# Altium project PCB_Project.PrjPcb
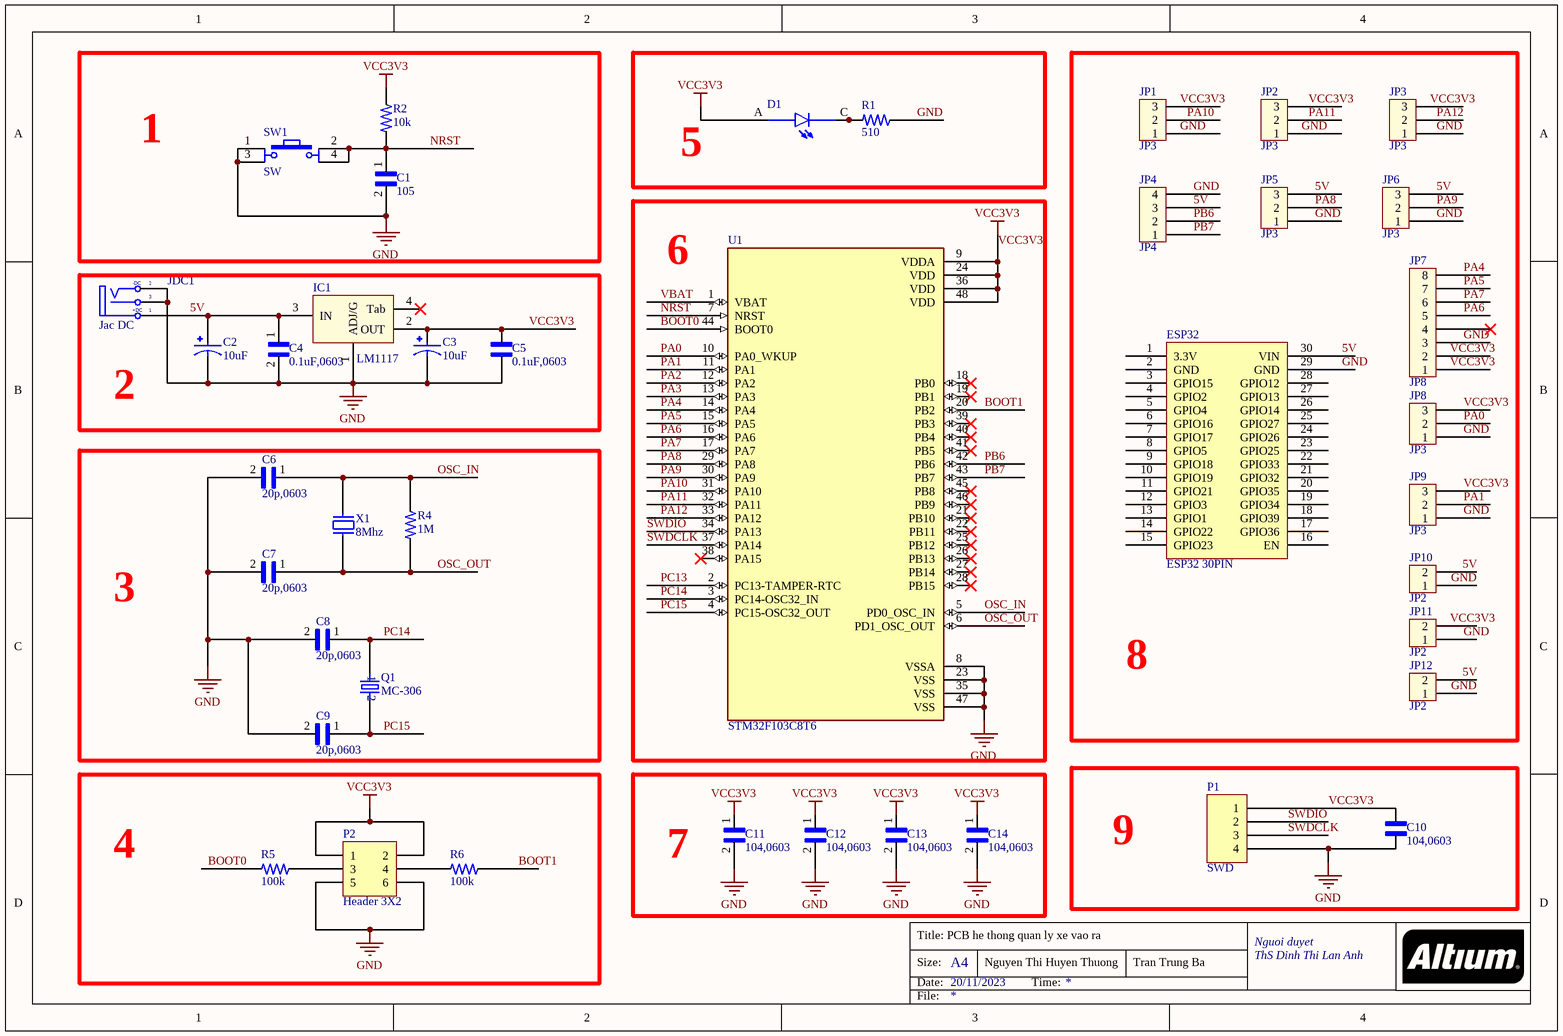
[diagram p0: Sheet1.SchDoc]
1 sheet, 41 parts. Net scope: global (net labels, ports and power ports of the same name join across sheets).
Board file: PCB1.PcbDoc

## Sheet Sheet1.SchDoc
size A4; Organization: Altium Limited; Address1: L3, 12a Rodborough Rd; Address2: Frenchs Forest; Address3: NSW; Address4: Australia 2086

### Parts
C1  105  [CAPC1608X90]
C2  10uF  [CAP_EEE1EA100WAR]
C3  10uF  [CAP_EEE1EA100WAR]
C4  0.1uF,0603  [CAPC1608X90]
C5  0.1uF,0603  [CAPC1608X90]
C6  20p,0603  [CAPC1608X90]
C7  20p,0603  [CAPC1608X90]
C8  20p,0603  [CAPC1608X90]
C9  20p,0603  [CAPC1608X90]
C10  104,0603  [CAPC1608X90]
C11  104,0603  [CAPC1608X90]
C12  104,0603  [CAPC1608X90]
C13  104,0603  [CAPC1608X90]
C14  104,0603  [CAPC1608X90]
D1  HSMS-C190  [LEDM1608X80]  (value not drawn)
ESP32  ESP32 30PIN  [ESP32 DOIT 30-PIN]
IC1  LM1117  [SOT223-4N]
JDC1  Jac DC  [DC-IN]
JP1  JP3  [CON3]
JP2  JP3  [CON3]
JP3  JP3  [CON3]
JP4  JP4  [CON4]
JP5  JP3  [CON3]
JP6  JP3  [CON3]
JP7  JP8  [CON8]
JP8  JP3  [CON3]
JP9  JP3  [CON3]
JP10  JP2  [CON2]
JP11  JP2  [CON2]
JP12  JP2  [CON2]
P1  SWD  [HDR1X4H]
P2  Header 3X2  [HDR2X3]
Q1  MC-306  [XT 306]
R1  510  [RESC1608X50N]
R2  10k  [RESC1608X50N]
R4  1M  [RESC1608X50N]
R5  100k  [RESC1608X50N]
R6  100k  [RESC1608X50N]
SW1  SW  [SW4]
U1  STM32F103C8T6  [QFP50P900X900X160-48N]
X1  8Mhz  [XT2]

### Nets
GND: C1.2 C2.2 C3.2 C4.2 C5.2 C6.2 C7.2 C8.2 C9.2 C10.2 C11.2 C12.2 C13.2 C14.2 ESP32.29(GND) IC1.1(ADJ/G) JDC1.2(TN) JDC1.3(S) JP1.1 JP2.1 JP3.1 JP4.4 JP5.1 JP6.1 JP7.3 JP8.1 JP9.1 JP10.1 JP11.1 JP12.1 P1.4 P2.5 P2.6 R1.1 SW1.1 SW1.3 U1.8(VSSA) U1.23(VSS) U1.35(VSS) U1.47(VSS)
VCC3V3: C3.1 C5.1 C10.1 C11.1 C12.1 C13.1 C14.1 D1.A IC1.2(OUT) JP1.3 JP2.3 JP3.3 JP7.1 JP7.2 JP8.3 JP9.3 JP11.2 P1.1 P2.1 P2.2 R2.1 U1.9(VDDA) U1.24(VDD) U1.36(VDD) U1.48(VDD)
5V: C2.1 C4.1 ESP32.30(VIN) IC1.3(IN) JDC1.1(T) JP4.3 JP5.3 JP6.3 JP10.2 JP12.2
BOOT0: R5.2 U1.44(BOOT0)
BOOT1: R6.1 U1.20(PB2)
NRST: C1.1 R2.2 SW1.2 SW1.4 U1.7(NRST)
OSC_IN: C6.1 R4.1 U1.5(PD0_OSC_IN) X1.2
OSC_OUT: C7.1 R4.2 U1.6(PD1_OSC_OUT) X1.1
PA0: JP8.2 U1.10(PA0_WKUP)
PA1: JP9.2 U1.11(PA1)
PA2: U1.12(PA2)
PA3: U1.13(PA3)
PA4: JP7.8 U1.14(PA4)
PA5: JP7.7 U1.15(PA5)
PA6: JP7.5 U1.16(PA6)
PA7: JP7.6 U1.17(PA7)
PA8: JP5.2 U1.29(PA8)
PA9: JP6.2 U1.30(PA9)
PA10: JP1.2 U1.31(PA10)
PA11: JP2.2 U1.32(PA11)
PA12: JP3.2 U1.33(PA12)
PB6: JP4.2 U1.42(PB6)
PB7: JP4.1 U1.43(PB7)
PC13: U1.2(PC13-TAMPER-RTC)
PC14: C8.1 Q1.1 U1.3(PC14-OSC32_IN)
PC15: C9.1 Q1.4 U1.4(PC15-OSC32_OUT)
SWDCLK: P1.3 U1.37(PA14)
SWDIO: P1.2 U1.34(PA13)
VBAT: U1.1(VBAT)
NetD1_C: D1.C R1.2
NetP2_3: P2.3 R5.1
NetP2_4: P2.4 R6.2

Not connected (* = marked no-connect by the designer): ESP32 1(3.3V) 2(GND) 3(GPIO15) 4(GPIO2) 5(GPIO4) 6(GPIO16) 7(GPIO17) 8(GPIO5) 9(GPIO18) 10(GPIO19) 11(GPIO21) 12(GPIO3) 13(GPIO1) 14(GPIO22) 15(GPIO23) 16(EN) 17(GPIO36) 18(GPIO39) 19(GPIO34) 20(GPIO35) 21(GPIO32) 22(GPIO33) 23(GPIO25) 24(GPIO26) 25(GPIO27) 26(GPIO14) 27(GPIO13) 28(GPIO12); IC1 4(Tab)*; JP7 4*; U1 18(PB0)* 19(PB1)* 21(PB10)* 22(PB11)* 25(PB12)* 26(PB13)* 27(PB14)* 28(PB15)* 38(PA15)* 39(PB3)* 40(PB4)* 41(PB5)* 45(PB8)* 46(PB9)*

### Notes on the sheet
- 1
- 5
- (near U1) 6
- 2
- 3
- 8
- 9
- 4
- (near C11) 7
- Title: PCB he thong quan ly xe vao ra
- Size:
- Date:
- 20/11/2023
- A4
- Nguyen Thi Huyen Thuong
- Time:
- Tran Trung Ba
- Nguoi duyet
- ThS Dinh Thi Lan Anh
- File:
- (in symbol DCIN) -DC; +DC

### Library data of the parts
C1 C4-C14 = CC0603MRX7R9BB272: CAP CER 2700PF 50V X7R 0603; Package: None; Price: None; Value: *; MP: CC0603MRX7R9BB272; Availability: Unavailable
C2 C3 = EEE1EA100WAR: 10ÂµF 25V Aluminum Electrolytic Capacitors Radial, Can - SMD 1000 Hrs @ 85Â°C; MF: Panasonic; Price: None; MP: EEE1EA100WAR; Purchase-URL: https://pricing.snapeda.com/search/part/EEE1EA100WAR/?ref=eda; Package: RADIAL-2 Panasonic; Check_prices: https://www.snapeda.com/parts/EEE1EA100WAR/Panasonic/view-part/?ref=eda; SnapEDA_Link: https://www.snapeda.com/parts/EEE1EA100WAR/Panasonic/view-part/?ref=snap; Value: *; Availability: In Stock
D1 = HSMS-C190: Red 626nm LED Indication - Discrete 2.1V 0603 _1608 Metric_; MF: Broadcom Limited; MP: HSMS-C190; Value: *; Package: 0603 Broadcom; Price: None; Availability: Unavailable; SnapEDA_Link: https://www.snapeda.com/parts/HSMS-C190/Broadcom%20Limited/view-part/1781258/?ref=snap
IC1 = LM1117: 3v3; Value: LM317
JDC1 = DCIN: Jac DC input; Value: Jac DC
JP1-JP3 JP5 JP6 JP8 JP9 = Con3: Connector 3; Value: Connector 3
JP4 = Con4: Connector 4; Value: Connector 4
JP7 = Con8: Connector 8; Value: Connector 8
JP10-JP12 = Con2: Connector 2; Value: Connector 2
P1 = Header 4H: Header, 4-Pin, Right Angle; LatestRevisionDate: 17-Jul-2002; LatestRevisionNote: Re-released for DXP Platform.; Publisher: Altium Limited
P2 = Header 3X2: Header, 3-Pin, Dual row; LatestRevisionDate: 17-Jul-2002; LatestRevisionNote: Re-released for DXP Platform.; Publisher: Altium Limited
Q1 = MC-306: 32.768kHz Â±100ppm Crystal 12.5pF 50 kOhms 4-SOJ, 5.50mm pitch; MF: Aigner; MP: MC-306; Price: None; Availability: Unavailable; Package: 4-4 Aigner; SnapEDA_Link: https://www.snapeda.com/parts/MC-306/Aigner/view-part/342220/?ref=snap; Value: *
R1 R2 R4-R6 = 2176051-4: RES 0.068 OHM 1% 1/8W 0603; Power_Rating: .125 W; MF: TE Connectivity; Resistance: .068; Value: *; Availability: Unavailable; Tolerance: 1%; Price: None; EU_RoHS_Compliance: Compliant with Exemptions; SnapEDA_Link: https://www.snapeda.com/parts/2176051-4/TE%20Connectivity/view-part/2213257/?ref=snap; Package: 0603; MP: 2176051-4
SW1 = SW4: Switch button 4 pin; Value: Button chip 4 pin
U1 = STM32F103C8T6: ARMÂ® CortexÂ®-M3 STM32F1 Microcontroller IC 32-Bit 72MHz 64KB _64K x 8_ FLASH; MF: STMicroelectronics; Price: None; Package: LQFP-48 STMicroelectronics; Value: *; MP: STM32F103C8T6; Availability: Unavailable; SnapEDA_Link: https://www.snapeda.com/parts/STM32F103C8T6/STMicroelectronics/view-part/52195/?ref=snap
X1 = XT2: Crystal For all Crystal 2pin.; Value: 4Mhz